# EasyEDA Pro project MB2_B1.epro

# Schematic ROCK_MB_R1
Board Name: ROCK_MB_R1; Create Date: 2025-02-02; Page Name: Sheet_1; Project Name: ROCK_MB2_R1; Schematic Name: ROCK_MB_R1; Update Date: 2025-02-06; Add into BOM: yes; Company: BCDN; Convert to PCB: yes; Date: 2025-01-31; Draw By: Lloyd Cargo; REV: 1.0; Sheet: 1/1
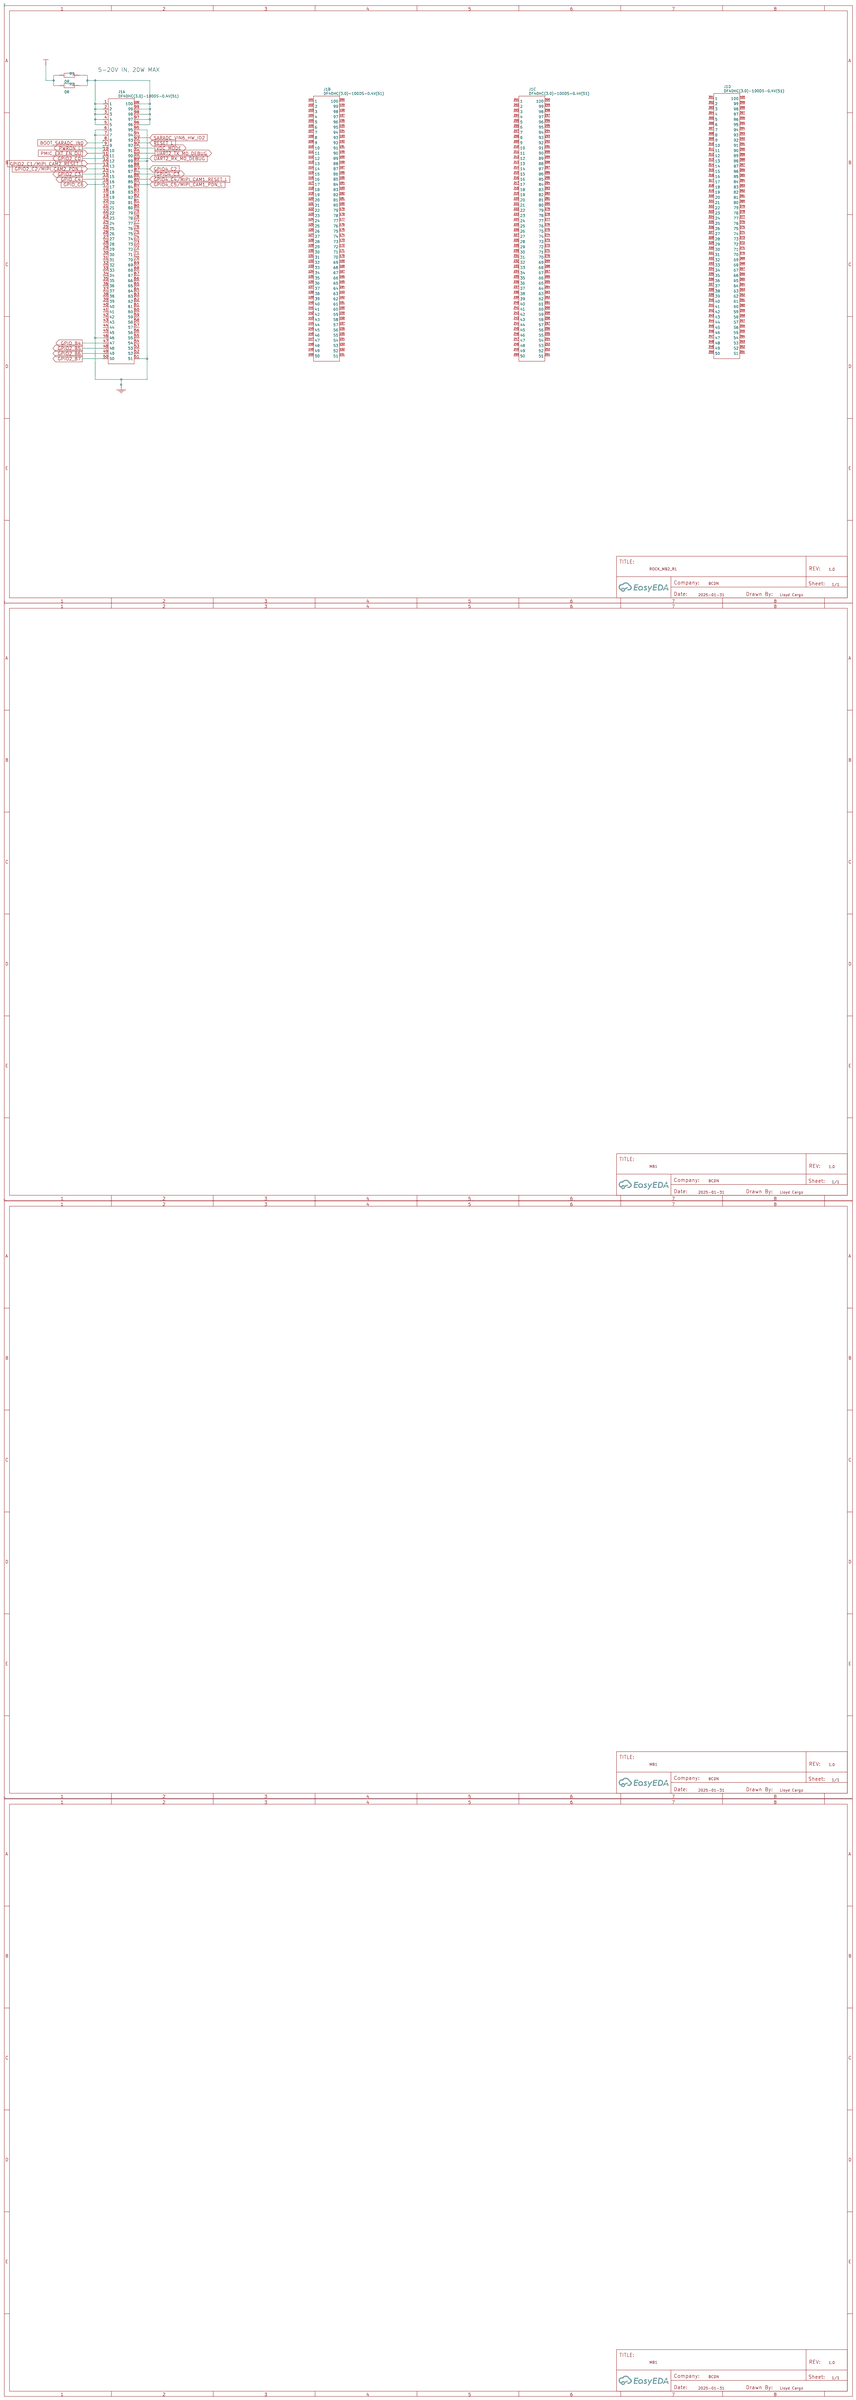
[diagram p0: schematic sheet]

## Parts
J1A  DF40HC(3.0)-100DS-0.4V(51)  [CONN-SMD_DF40HC-3.0-100DS-0.4V-51]
J1B  DF40HC(3.0)-100DS-0.4V(51)  [CONN-SMD_DF40HC-3.0-100DS-0.4V-51]
J1C  DF40HC(3.0)-100DS-0.4V(51)  [CONN-SMD_DF40HC-3.0-100DS-0.4V-51]
J1D  DF40HC(3.0)-100DS-0.4V(51)  [CONN-SMD_DF40HC-3.0-100DS-0.4V-51]
R1  0R  [R0603]
R2  0R  [R0603]

## Library data of the parts
J1A J1B J1C J1D = DF40HC(3.0)-100DS-0.4V(51): Supplier: LCSC; Supplier Part: C424649; Manufacturer: HRS(广濑); JLCPCB Part Class: Extended Part
R1 R2 = Res_0603: Supplier Footprint: 0603

## Nets
GND: J1A.6 J1A.7 J1A.46 J1A.51 J1A.89 J1A.95
VDD_12V: R1.1 R2.1
BOOT_SARADC_IN0: J1A.8
GPIO2_B5: J1A.48
GPIO2_B6: J1A.49
GPIO2_B7: J1A.50
GPIO2_C0: J1A.11
GPIO2_C1/MIPI_CAM2_RESET_L: J1A.12
GPIO2_C2/MIPI_CAM2_PDN_L: J1A.13
GPIO2_C3: J1A.14
GPIO4_C2: J1A.88
GPIO4_C3: J1A.87
GPIO4_C4/MIPI_CAM1_RESET_L: J1A.86
GPIO4_C5/MIPI_CAM1_PDN_L: J1A.85
GPIO_B4: J1A.47
GPIO_C4: J1A.15
GPIO_C6: J1A.16
PMIC_EXT_EN_OUT: J1A.10
PWRON_L: J1A.9
RESET_L: J1A.93
SARADC_VIN6_HW_ID2: J1A.94
UART2_RX_M0_DEBUG: J1A.90
UART2_TX_M0_DEBUG: J1A.91
VDC_MODE: J1A.92
Net-(J1A-1): J1A.1 J1A.2 J1A.3 J1A.4 J1A.5 J1A.96 J1A.97 J1A.98 J1A.99 J1A.100 R1.2 R2.2

Not connected (* = marked no-connect by the designer): J1A 17 18 19 20 21 22 23 24 25 26 27 28 29 30 31 32 33 34 35 36 37 38 39 40 41 42 43 44 45 52 53 54 55 56 57 58 59 60 61 62 63 64 65 66 67 68 69 70 71 72 73 74 75 76 77 78 79 80 81 82 83 84; J1B 101(1) 102(2) 103(3) 104(4) 105(5) 106(6) 107(7) 108(8) 109(9) 110(10) 111(11) 112(12) 113(13) 114(14) 115(15) 116(16) 117(17) 118(18) 119(19) 120(20) 121(21) 122(22) 123(23) 124(24) 125(25) 126(26) 127(27) 128(28) 129(29) 130(30) 131(31) 132(32) 133(33) 134(34) 135(35) 136(36) 137(37) 138(38) 139(39) 140(40) 141(41) 142(42) 143(43) 144(44) 145(45) 146(46) 147(47) 148(48) 149(49) 150(50) 151(51) 152(52) 153(53) 154(54) 155(55) 156(56) 157(57) 158(58) 159(59) 160(60) 161(61) 162(62) 163(63) 164(64) 165(65) 166(66) 167(67) 168(68) 169(69) 170(70) 171(71) 172(72) 173(73) 174(74) 175(75) 176(76) 177(77) 178(78) 179(79) 180(80) 181(81) 182(82) 183(83) 184(84) 185(85) 186(86) 187(87) 188(88) 189(89) 190(90) 191(91) 192(92) 193(93) 194(94) 195(95) 196(96) 197(97) 198(98) 199(99) 200(100); J1C 201(1) 202(2) 203(3) 204(4) 205(5) 206(6) 207(7) 208(8) 209(9) 210(10) 211(11) 212(12) 213(13) 214(14) 215(15) 216(16) 217(17) 218(18) 219(19) 220(20) 221(21) 222(22) 223(23) 224(24) 225(25) 226(26) 227(27) 228(28) 229(29) 230(30) 231(31) 232(32) 233(33) 234(34) 235(35) 236(36) 237(37) 238(38) 239(39) 240(40) 241(41) 242(42) 243(43) 244(44) 245(45) 246(46) 247(47) 248(48) 249(49) 250(50) 251(51) 252(52) 253(53) 254(54) 255(55) 256(56) 257(57) 258(58) 259(59) 260(60) 261(61) 262(62) 263(63) 264(64) 265(65) 266(66) 267(67) 268(68) 269(69) 270(70) 271(71) 272(72) 273(73) 274(74) 275(75) 276(76) 277(77) 278(78) 279(79) 280(80) 281(81) 282(82) 283(83) 284(84) 285(85) 286(86) 287(87) 288(88) 289(89) 290(90) 291(91) 292(92) 293(93) 294(94) 295(95) 296(96) 297(97) 298(98) 299(99) 300(100); J1D 301(1) 302(2) 303(3) 304(4) 305(5) 306(6) 307(7) 308(8) 309(9) 310(10) 311(11) 312(12) 313(13) 314(14) 315(15) 316(16) 317(17) 318(18) 319(19) 320(20) 321(21) 322(22) 323(23) 324(24) 325(25) 326(26) 327(27) 328(28) 329(29) 330(30) 331(31) 332(32) 333(33) 334(34) 335(35) 336(36) 337(37) 338(38) 339(39) 340(40) 341(41) 342(42) 343(43) 344(44) 345(45) 346(46) 347(47) 348(48) 349(49) 350(50) 351(51) 352(52) 353(53) 354(54) 355(55) 356(56) 357(57) 358(58) 359(59) 360(60) 361(61) 362(62) 363(63) 364(64) 365(65) 366(66) 367(67) 368(68) 369(69) 370(70) 371(71) 372(72) 373(73) 374(74) 375(75) 376(76) 377(77) 378(78) 379(79) 380(80) 381(81) 382(82) 383(83) 384(84) 385(85) 386(86) 387(87) 388(88) 389(89) 390(90) 391(91) 392(92) 393(93) 394(94) 395(95) 396(96) 397(97) 398(98) 399(99) 400(100)

## Notes on the sheet
- 5-20V IN, 20W MAX
